# EAGLE design MCAT-CANYVAL-BPR-5X (EAGLE 7.2.0)
DATECODE: 20150302102847; REV: 5X
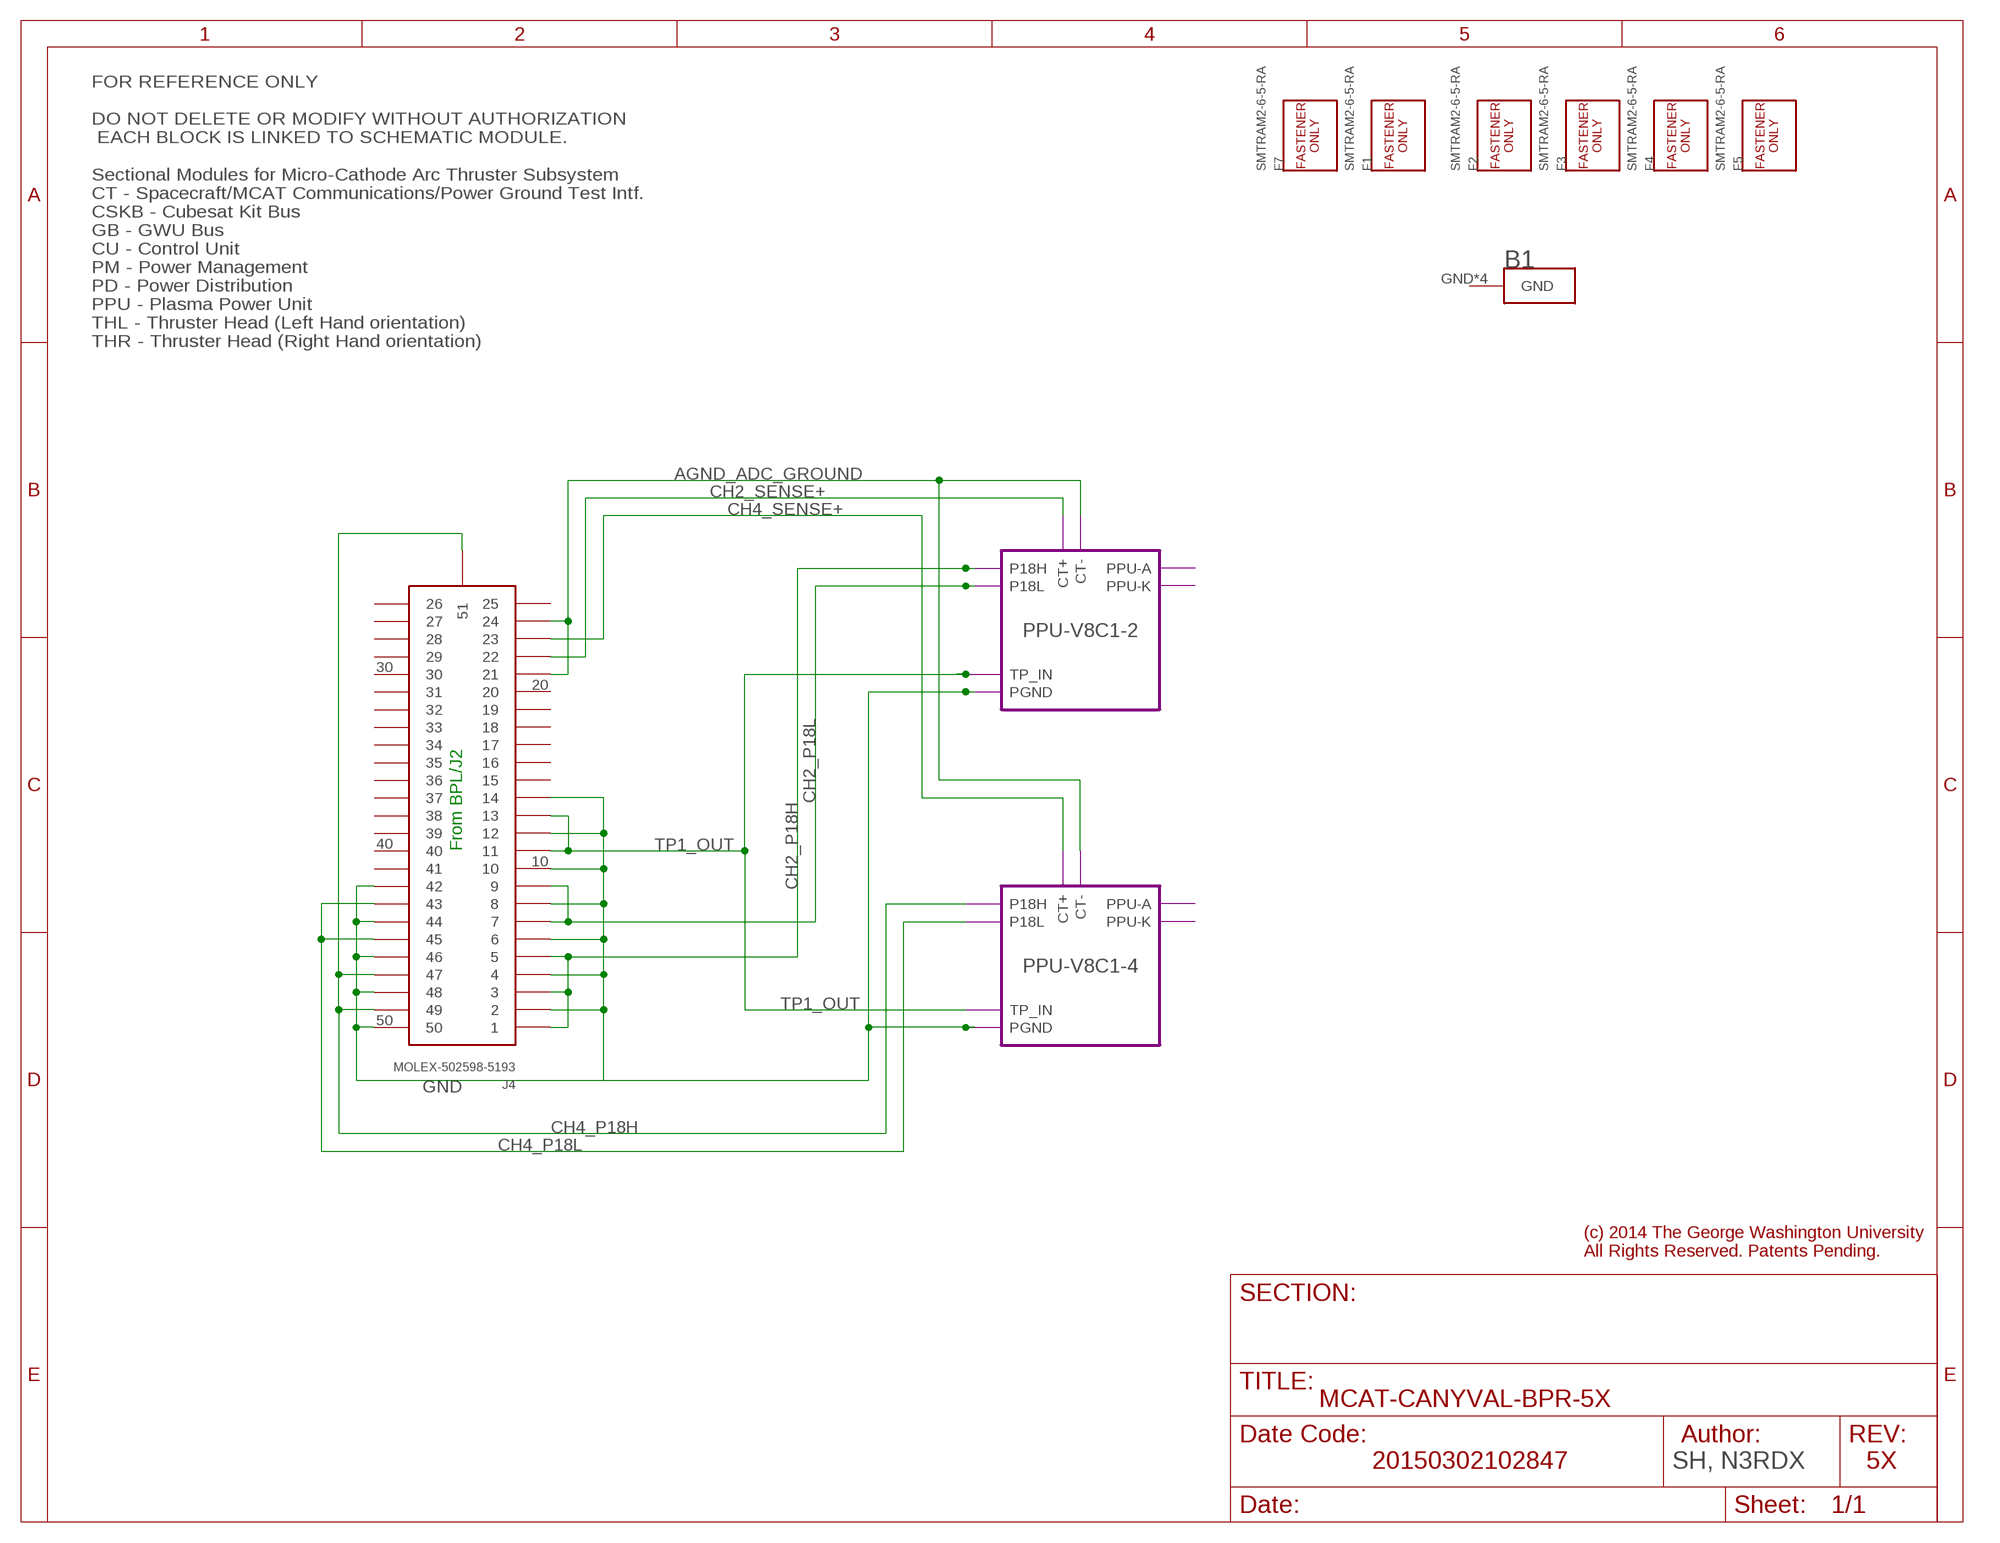
[diagram p0: schematic, sheet 1]

## Parts
B1  MCAT-4CU-C-PCB/BPR  [MCAT-4CU-C-BPR-V4-BLANK]
F1  SMTRAM2-6-5-RA  [SMTRA-M2-6-5-RA]
F2  SMTRAM2-6-5-RA  [SMTRA-M2-6-5-RA]
F3  SMTRAM2-6-5-RA  [SMTRA-M2-6-5-RA]
F4  SMTRAM2-6-5-RA  [SMTRA-M2-6-5-RA]
F5  SMTRAM2-6-5-RA  [SMTRA-M2-6-5-RA]
F7  SMTRAM2-6-5-RA  [SMTRA-M2-6-5-RA]
J4  MOLEX-502598-5193  [MOLEX-502598-5193]

## Module instances
PPU-V8C1-2 = PPU-V8C1
PPU-V8C1-4 = PPU-V8C1

## Nets
AGND_ADC_GROUND: J4.21 J4.24 ; port PPU-V8C1-2.CT- PPU-V8C1-4.CT-
CH2_P18H: J4.1 J4.3 J4.5 ; port PPU-V8C1-2.P18H
CH2_P18L: J4.7 J4.9 ; port PPU-V8C1-2.P18L
CH2_SENSE+: J4.22 ; port PPU-V8C1-2.CT+
CH4_P18H: J4.47 J4.49 J4.51 ; port PPU-V8C1-4.P18H
CH4_P18L: J4.43 J4.45 ; port PPU-V8C1-4.P18L
CH4_SENSE+: J4.23 ; port PPU-V8C1-4.CT+
GND: J4.2 J4.4 J4.6 J4.8 J4.10 J4.12 J4.14 J4.42 J4.44 J4.46 J4.48 J4.50 ; port PPU-V8C1-2.PGND PPU-V8C1-4.PGND
N$3: port PPU-V8C1-2.PPU-K
TP1_OUT: J4.11 J4.13 ; port PPU-V8C1-2.TP_IN PPU-V8C1-4.TP_IN
Unconnected: B1.GND B1.GND@1(GND) B1.GND@2(GND) B1.GND@3(GND) J4.15 J4.16 J4.17 J4.18 J4.19 J4.20 J4.25 J4.26 J4.27 J4.28 J4.29 J4.30 J4.31 J4.32 J4.33 J4.34 J4.35 J4.36 J4.37 J4.38 J4.39 J4.40 J4.41

## Notes on the sheet
- FOR REFERENCE ONLY
  
  DO NOT DELETE OR MODIFY WITHOUT AUTHORIZATION
   EACH BLOCK IS LINKED TO SCHEMATIC MODULE.
  
  Sectional Modules for Micro-Cathode Arc Thruster Subsystem
  CT - Spacecraft/MCAT Communications/Power Ground Test Intf.
  CSKB - Cubesat Kit Bus
  GB - GWU Bus
  CU - Control Unit
  PM - Power Management
  PD - Power Distribution
  PPU - Plasma Power Unit
  THL - Thruster Head (Left Hand orientation)
  THR - Thruster Head (Right Hand orientation)
- From BPL/J2
- SH, N3RDX

## Library data of the parts
B1 = gwu_mpnl_ucat_v10:MCAT-4CU-C-PCB; COPYRIGHT: (c) 2015. The George Washington University; PCBLABEL: BPR
F1-F5 F7 = gwu_mpnl_ucat_v10:SMTRA: Type SMTRA - ReelFast Surface Mount Right Angle (R'ANGLE) Fastener (Metric); MF: PENNEngineering; MPN: SMTRAM2-6-5ET
J4 = gwu_mpnl_ucat_v10:MOLEX-502598-5193: MOLEX 0.3MM PITCH FPC CONN MALE 51 CKTS MOLEX 502598-5193 based upon SD-502598-003 (2012/08/01); MF: MOLEX; MPN: 502598-5193

## Module PPU-V8C1
Ports: PGND(pwr) P18L(in) P18H(in) TP_IN(in) CT+(io) CT-(io) PPU-A(io) PPU-K(io)
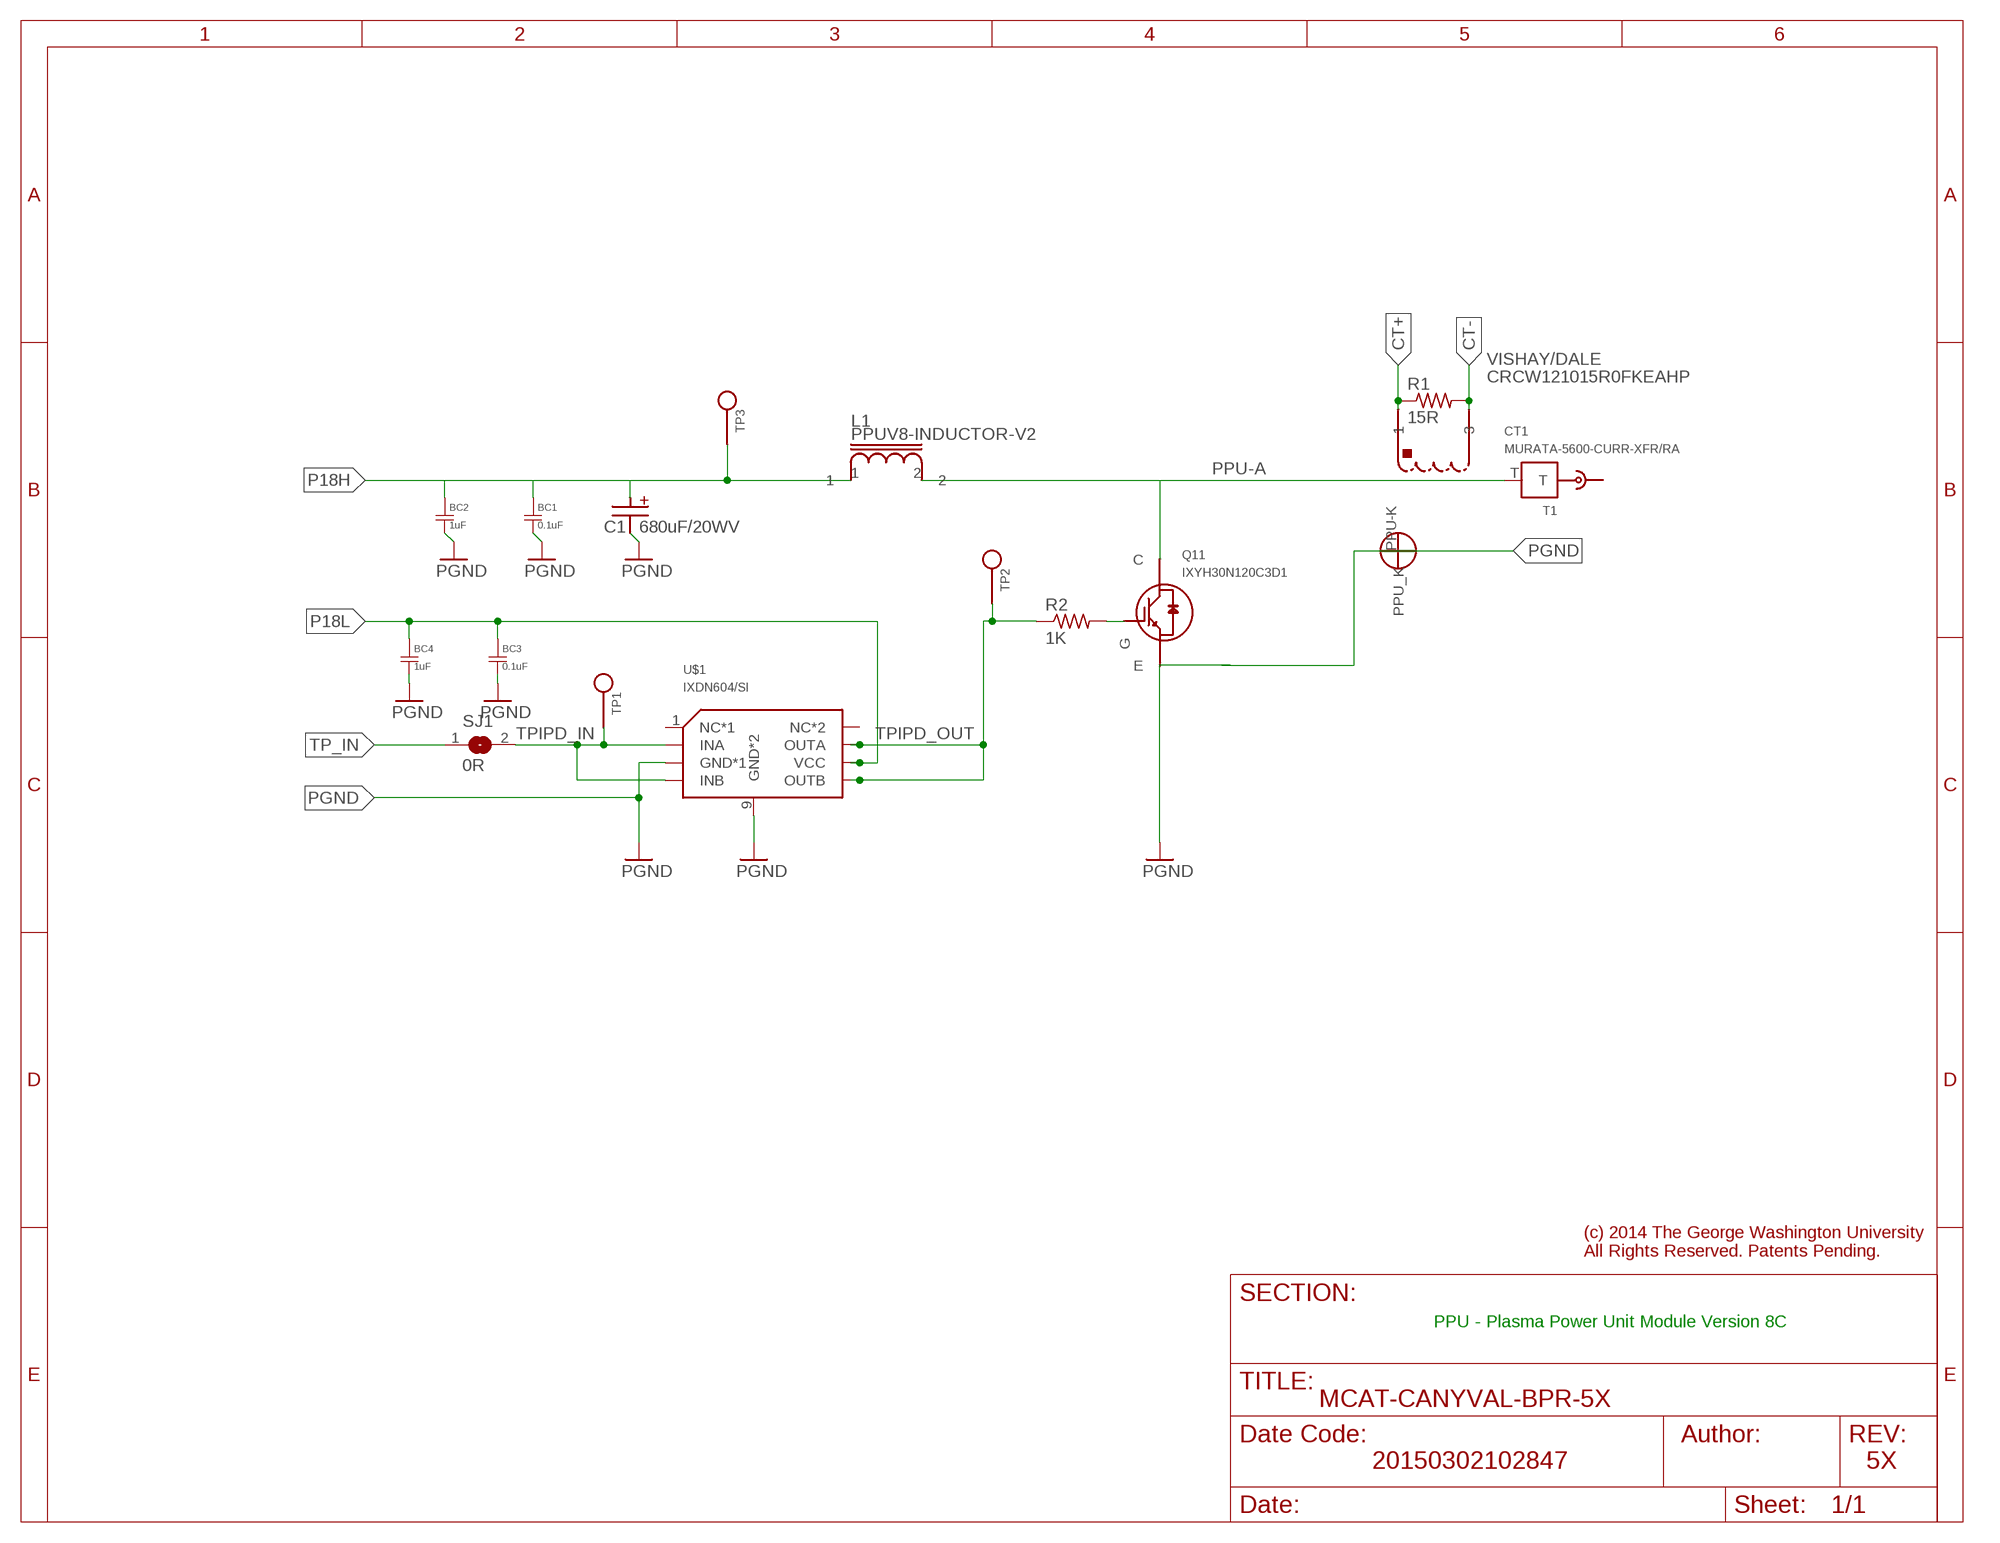
[diagram p1: schematic, module PPU-V8C1, sheet 1]

### Parts
BC1  BYPASS-CAP-0.1UF  [0612-REV]
BC2  BYPASS-CAP-1UF  [0612-REV]
BC3  BYPASS-CAP-0.1UF  [0612-REV]
BC4  BYPASS-CAP-1UF  [0612-REV]
C1  680uF/20WV  APSG200ELL681MJB5S  [CHEMI-CON-PSG-JB5]
CT1  MURATA-5600-CURR-XFR/RA  [MURATA-5600-SERIES-CURR-XFR-RA]
L1  PPUV8-INDUCTOR-V2  [PPUV8-INDUCTOR-V2]
Q11  IXYH30N120C3D1  IXYH30N120C3D1/V  [IXYS-TO-247-AD-VERT]
R1  15R  R-US_R1210  [R1210]
R2  1K  R-US_R0805  [R0805]
SJ1  0R  SJ  [SJ]
T1  MCAT-SPADE-TERMINAL  [SPADE-TERMINAL-FLANGED-NYLON-INSULATED]
TP1  PCB-MINI-SMD-TESTPOINT/SQ  [PCB-MINI-SMD-TESTPOINT]
TP2  PCB-MINI-SMD-TESTPOINT/SQ  [PCB-MINI-SMD-TESTPOINT]
TP3  PCB-MINI-SMD-TESTPOINT/SQ  [PCB-MINI-SMD-TESTPOINT]
U$1  IXDN604/SI  [IXYS-SI-8PIN-POWER-SOIC]

### Nets
CT+: CT1.1 R1.1
CT-: CT1.3 R1.2
N$2: Q11.G R2.2
P18H [P18H-0.6A-CKT]: BC1.1 BC2.1 C1.POS(CAP_POS) L1.1 TP3.1(TP)
P18L: BC3.1 BC4.1 U$1.6(VCC)
PGND: BC1.2 BC2.2 BC3.2 BC4.2 C1.NEG(CAP_NEG) CT1.PPU-K(PPU_K) Q11.E U$1.3(GND*1) U$1.9(GND*2)
PPU-A: L1.2 Q11.C T1.T
TP_IN: SJ1.1
TPIPD_IN: SJ1.2 TP1.1(TP) U$1.2(INA) U$1.4(INB)
TPIPD_OUT: R2.1 TP2.1(TP) U$1.5(OUTB) U$1.7(OUTA)
Unconnected: U$1.1(NC*1) U$1.8(NC*2)

### Notes on the sheet
- PPU - Plasma Power Unit Module Version 8C

### Library data of the parts
BC1 BC3 = gwu_mpnl_ucat_v10:BYPASS-CAP-0.1UF; MF: AVX; MPN: 06123C104KAT2A
BC2 BC4 = gwu_mpnl_ucat_v10:BYPASS-CAP-1UF; MF: AVX; MPN: 0612YC105KAT2A
C1 = samudra_ucat_v9:APSG200ELL681MJB5S; MF: United Chemi-Con; MPN: APSG200ELL681MJB5S
CT1 = gwu_mpnl_ucat_v10:MURATA-5600-CURR-XFR; MF: MURATA; MPN: 56050C
L1 = gwu_mpnl_ucat_v10:PPUV8-INDUCTOR-V2: GWU MpNL Custom Wound Inductor for PPUV8 1 x 1 Magnetics High Flux 58312A2 Core Winding: 18AWG Magnet Wire. Turns: See analysis report by HAQUE March 2015; MF: Magnetics; MPN: 58312-A2
Q11 = gwu_mpnl_ucat_v10:IXYH30N120C3D1; MF: IXYS; MPN: IXYH30N120C3D1
R1 = rcl:R-US_: RESISTOR, American symbol; MF: VISHAY/DALE; MPN: CRCW121015R0FKEAHP
R2 = rcl:R-US_: RESISTOR, American symbol; MF: VISHAY; MPN: PAT0805E1001BST1
SJ1 = jumper:SJ: SMD solder JUMPER; MF: VISHAY/DALE; MPN: CRCW08050000Z0EA
T1 = gwu_mpnl_ucat_v10:MCAT-SPADE-TERMINAL; MF: HARWIN; MPN: S4011-46
TP1-TP3 = gwu_mpnl_ucat_v10:PCB-MINI-SMD-TESTPOINT; MF: Keystone Electronics; MPN: 5015
U$1 = gwu_mpnl_ucat_v10:IXDN604; MF: IXYS; MPN: IXDN604SI

## Net classes
1 P18H-0.6A-CKT: width 0.203 mm
2 VOUTA-2A-CKT: width 1.016 mm

## Board
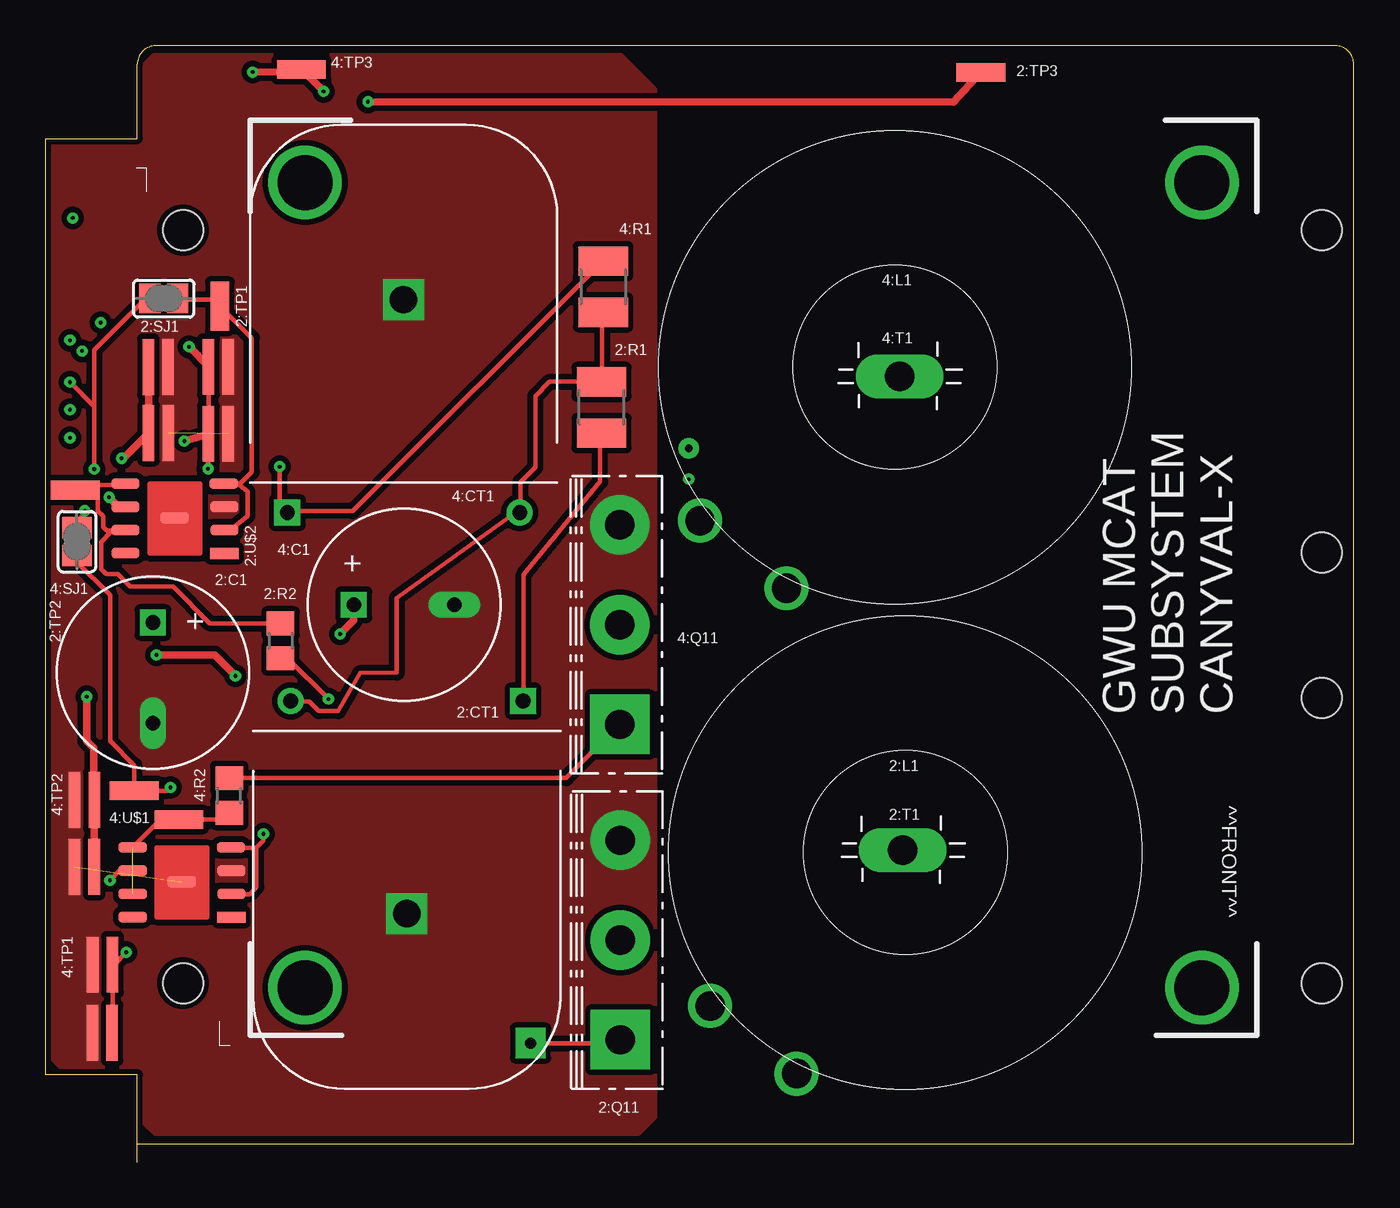
[diagram p2: board, top side]
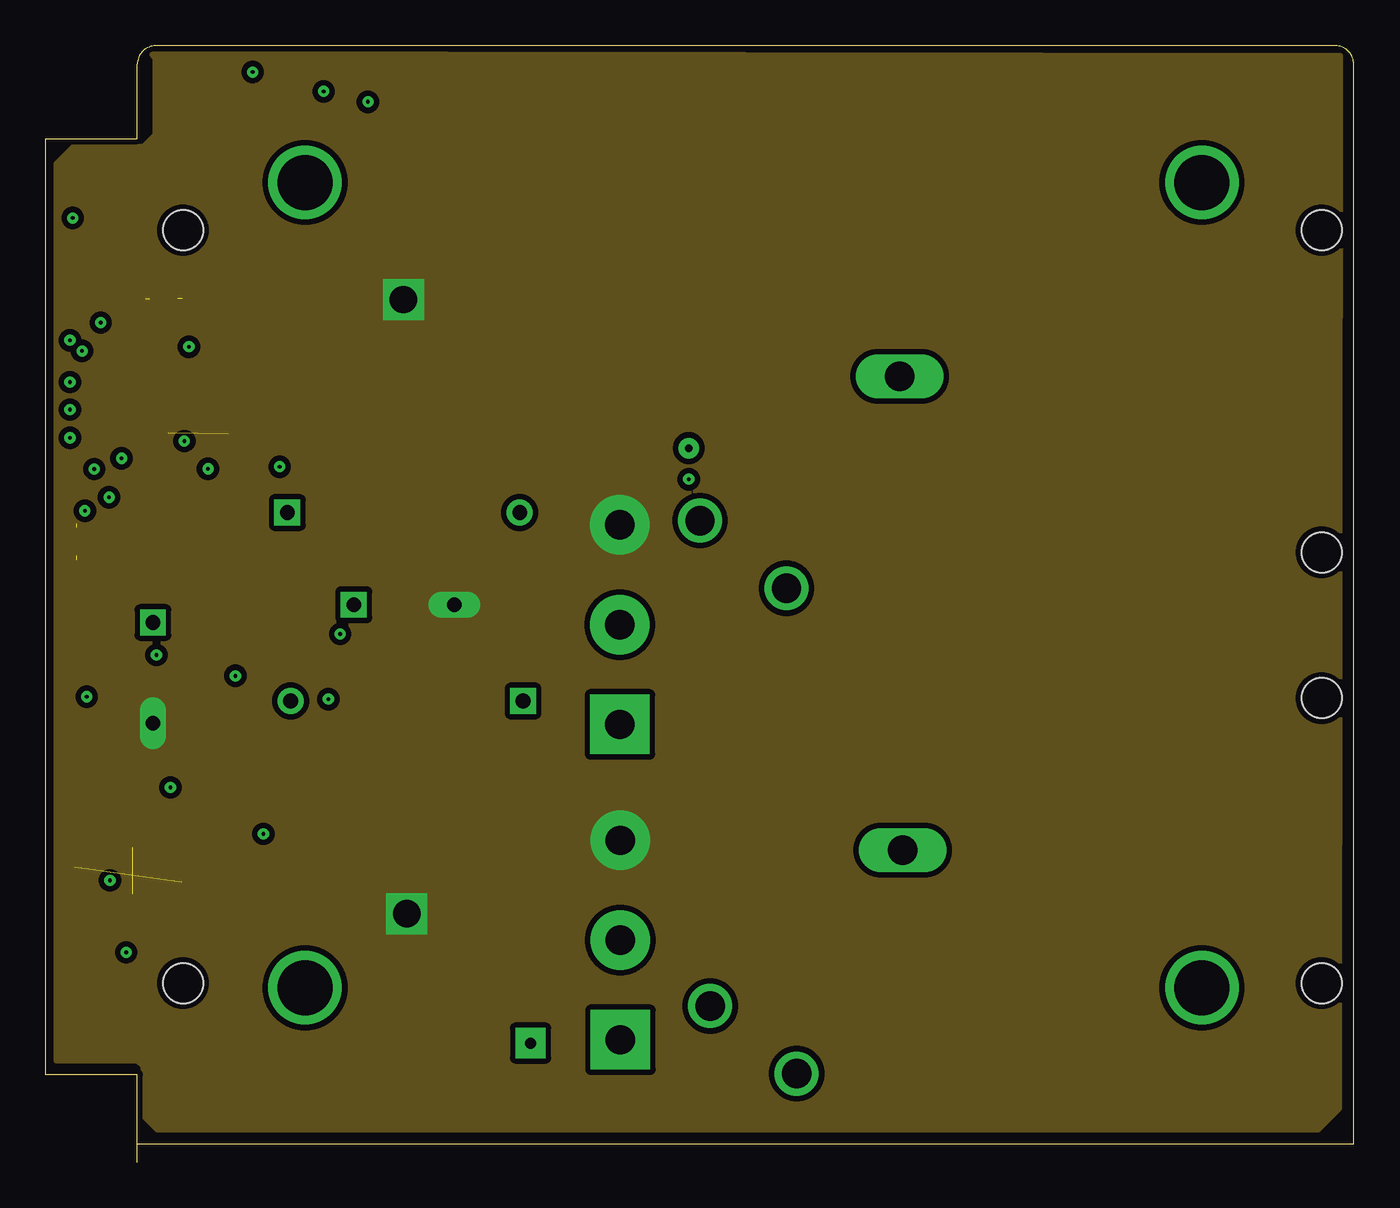
[diagram p3: board, inner layer L2/TopGround]
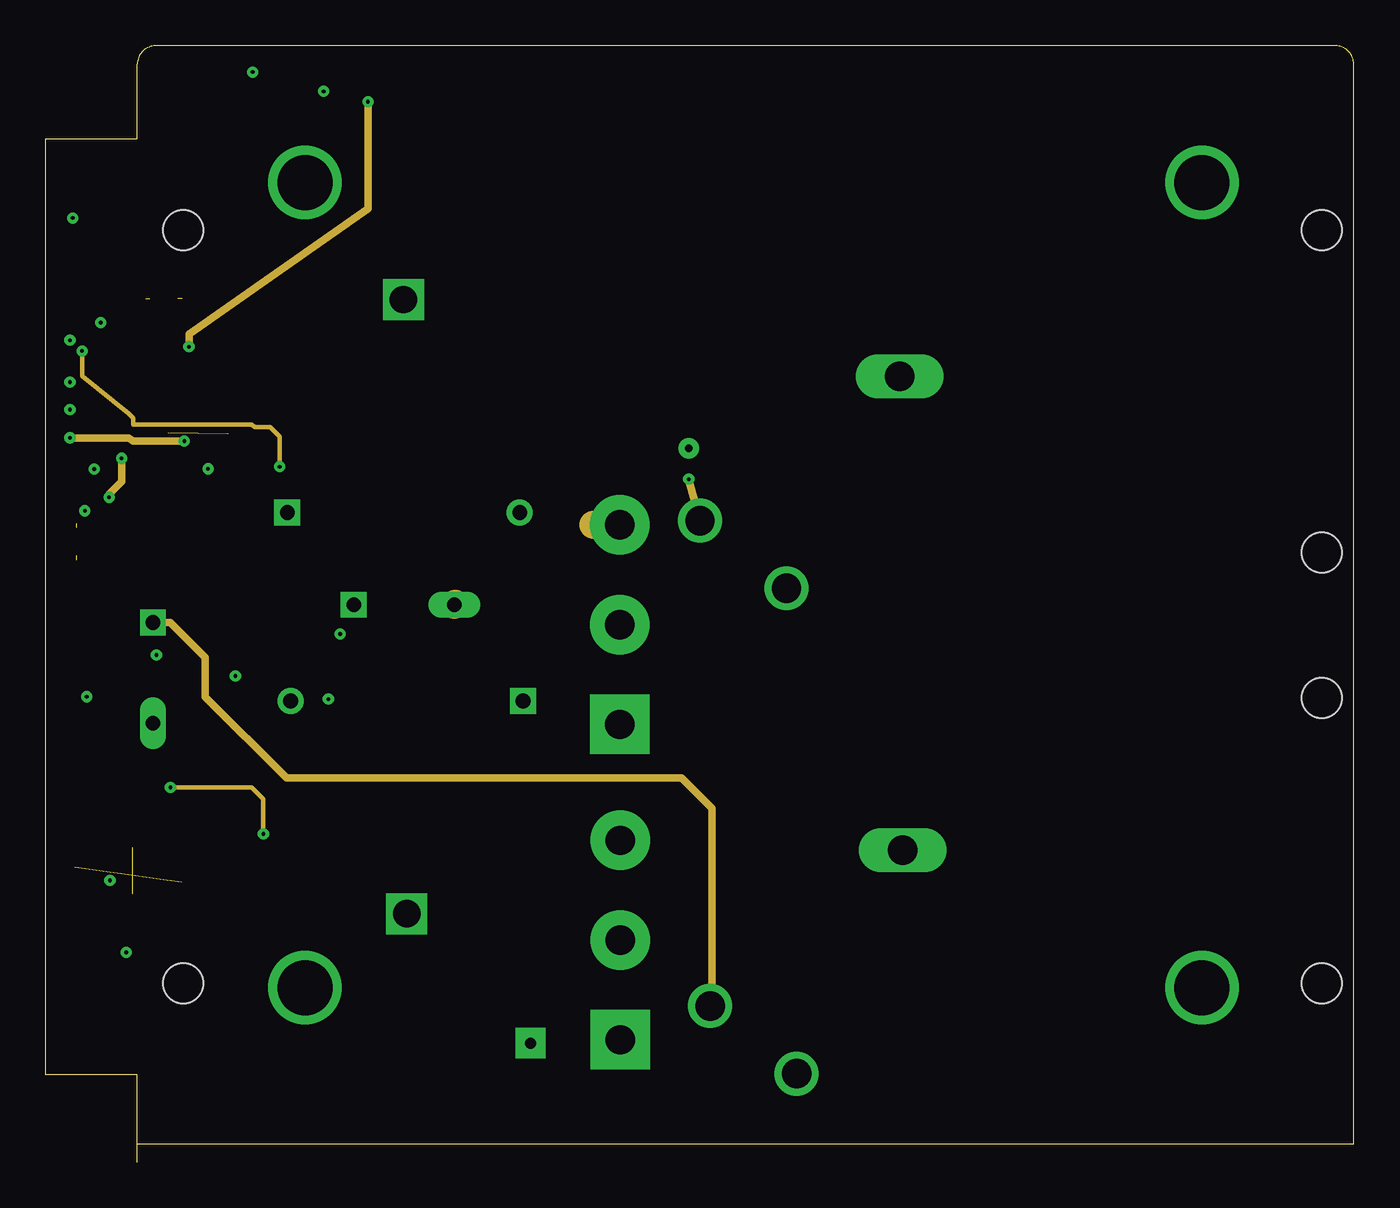
[diagram p4: board, inner layer L3/Power1]
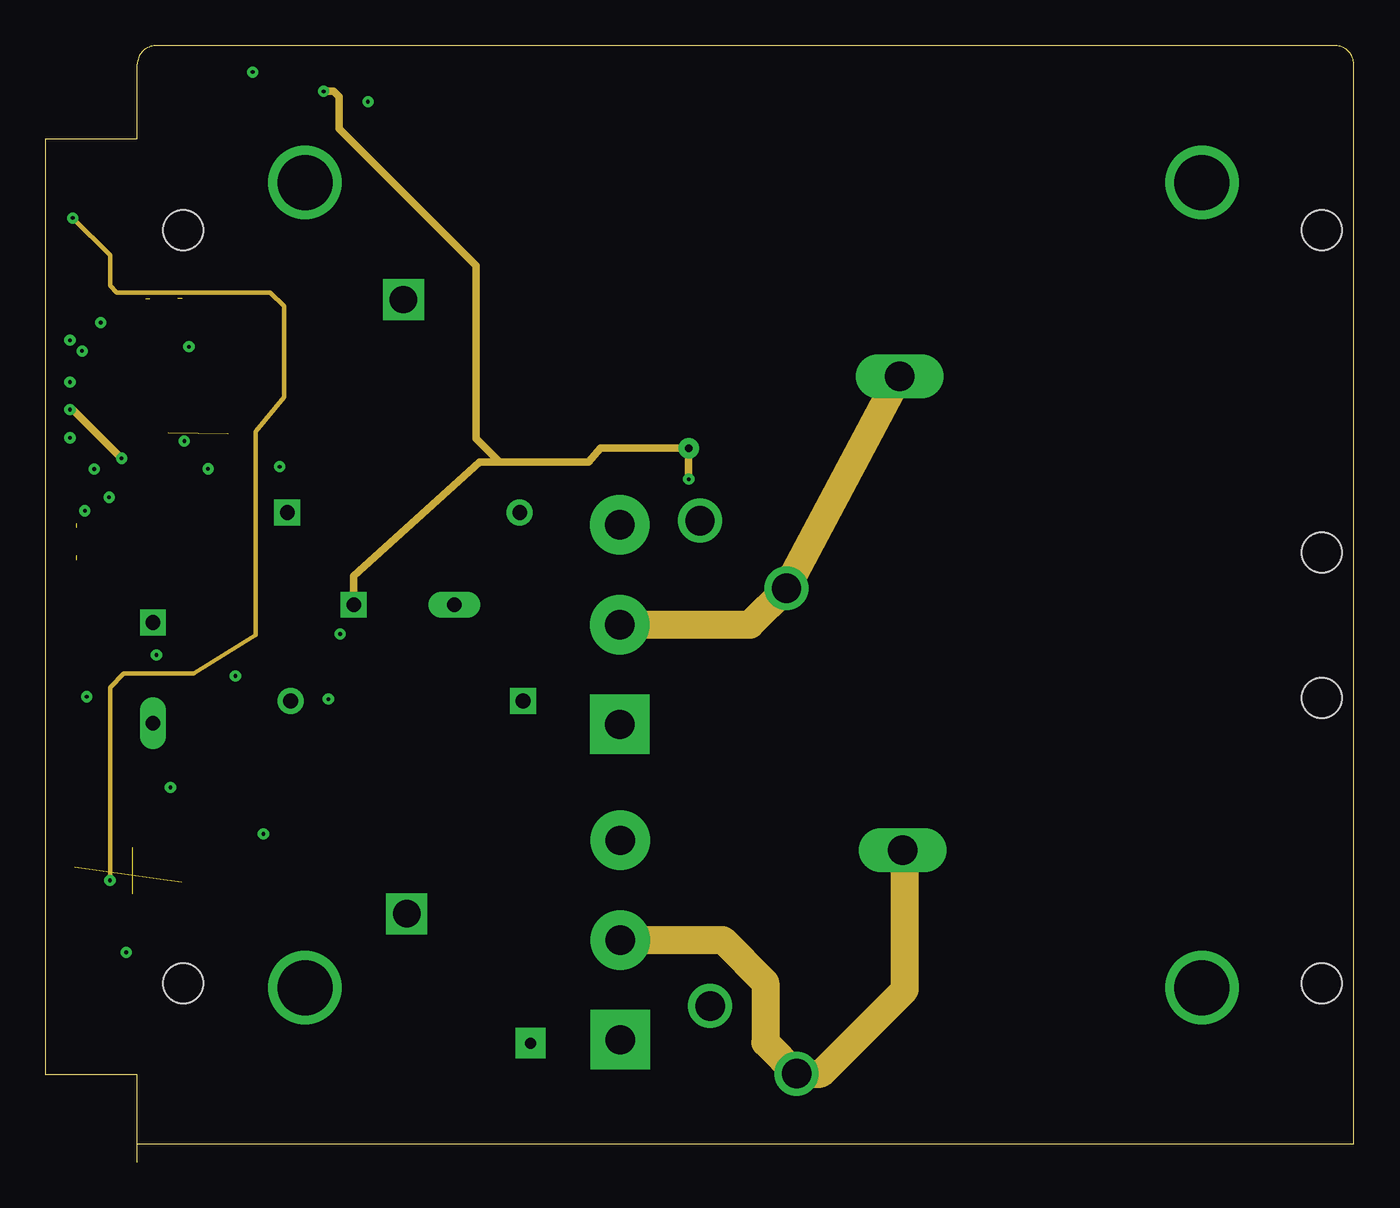
[diagram p5: board, inner layer L14/Power2]
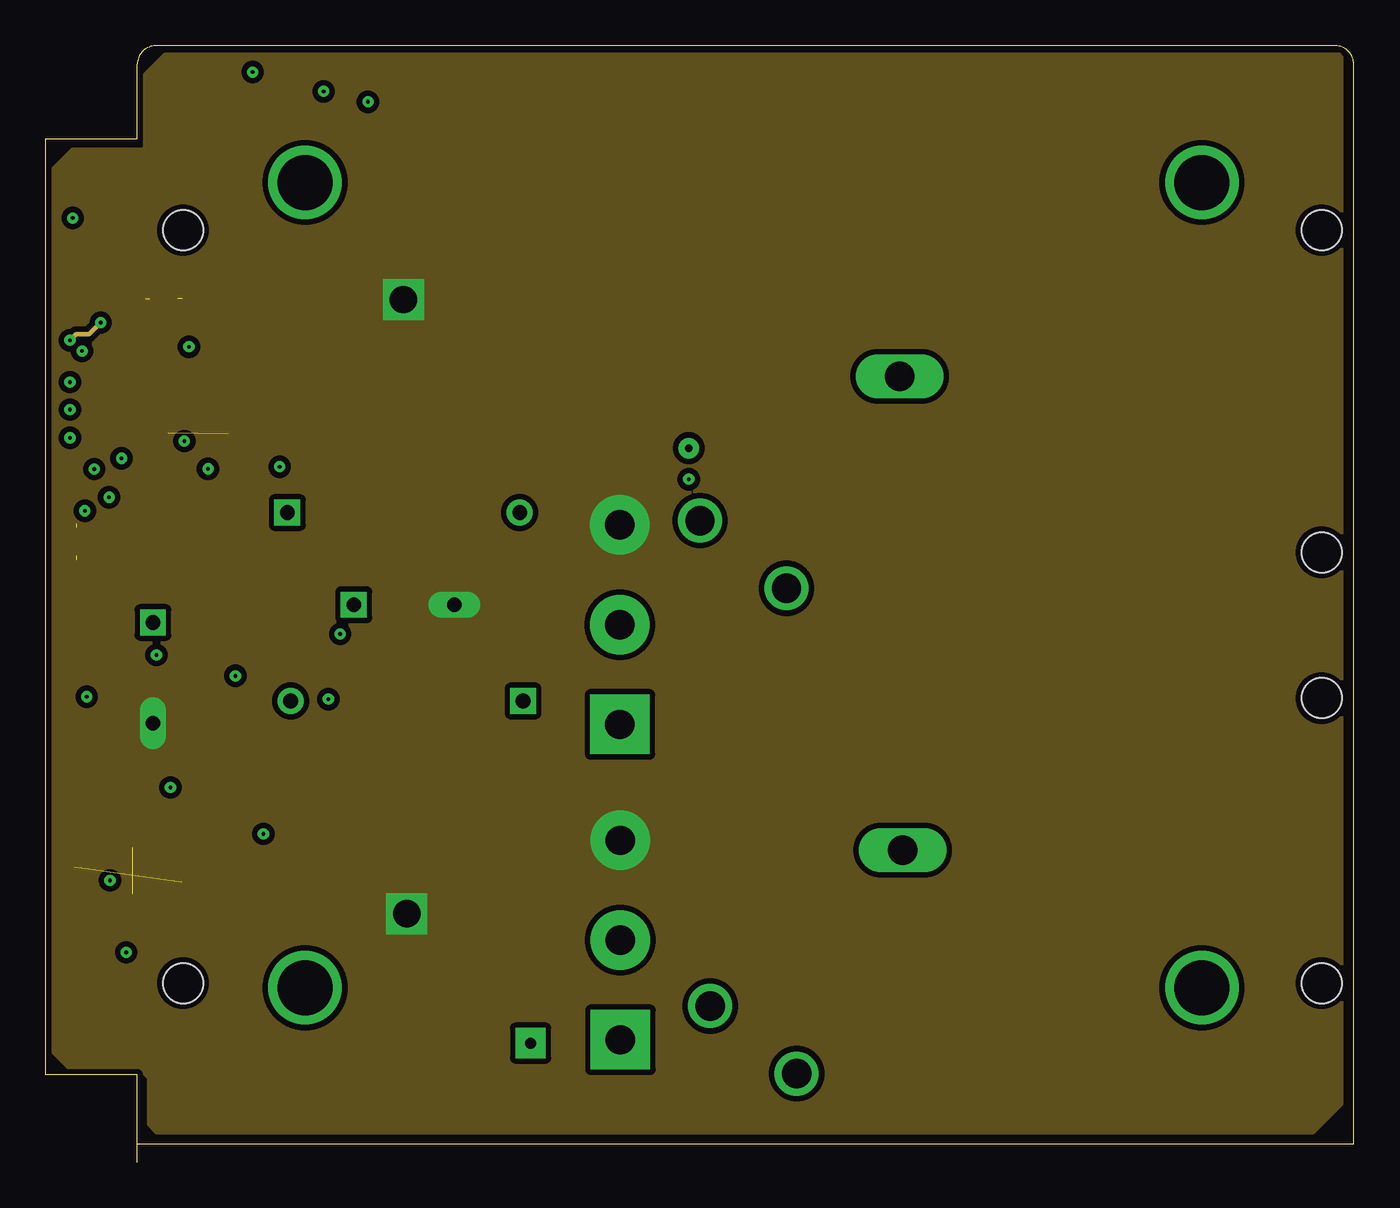
[diagram p6: board, inner layer L15/BottomGround]
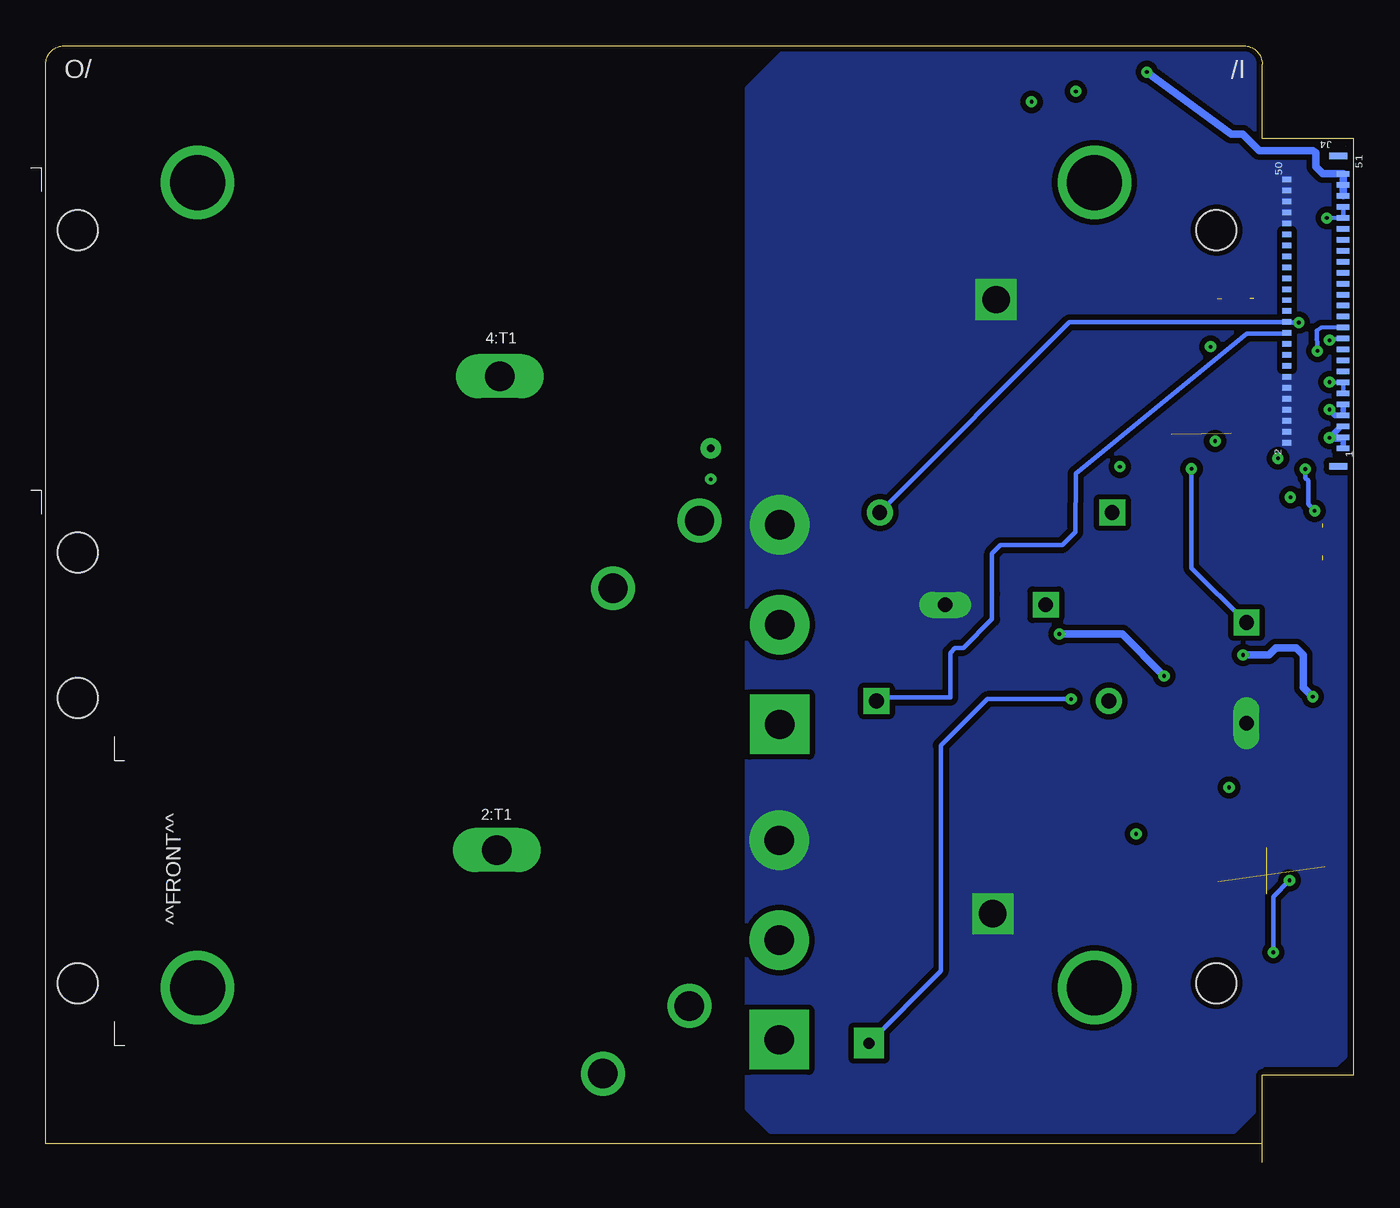
[diagram p7: board, bottom side, seen from below]

Size 71.47 x 61 mm. Coordinates in mm from the lower left corner, seen from the top.
Copper layers (1+2*3+14*15+16): L1/TopSignal 0.035559375mm / dielectric 3.5mil / L2/TopGround 0.01778125mm / dielectric 47mil / L3/Power1 0.0356mm / dielectric 12mil / L14/Power2 0.0356mm / dielectric 0.1499mm / L15/BottomGround 0.01778125mm / dielectric 3.5mil / L16/BottomSignal 0.035559375mm
Design rules "mcat-4cu-c-X3": minimum track width 6mil, minimum drill 8mil, track to track 10mil, track to pad 6mil, pad to pad 6mil, via to via 6mil, smd to smd 1mil, copper to edge 10mil, drill to drill 5mil, minimum pad ring 12mil, minimum via ring 8mil, stop-mask expansion 0mil, vias tented up to drill 8mil, thermal gap 10mil

### Footprints (pad centres in the part's own frame; a part is rotated, then mirrored left to right if it is on the bottom)
MCAT-4CU-C-BPR-V4-BLANK = drill 3: GND 9.17,9.025; GND@1 9.17,53.025; GND@2 58.17,53.025; GND@3 58.17,9.025
SMTRA-M2-6-5-RA = hole 2.2: 0,0
MOLEX-502598-5193 = smd 0.3 x 0.67: 1 -7.5,0.135; 3 -6.9,0.135; 5 -6.3,0.135; 7 -5.7,0.135; 9 -5.1,0.135; 11 -4.5,0.135; 13 -3.9,0.135; 15 -3.3,0.135; 17 -2.7,0.135; 19 -2.1,0.135; 21 -1.5,0.135; 23 -0.9,0.135; 25 -0.3,0.135; 27 0.3,0.135; 29 0.9,0.135; 31 1.5,0.135; 33 2.1,0.135; 35 2.7,0.135; 37 3.3,0.135; 39 3.9,0.135; 41 4.5,0.135; 43 5.1,0.135; 45 5.7,0.135; 47 6.3,0.135; 49 6.9,0.135; 51 7.5,0.135 | smd 0.3 x 0.5: 2 -7.2,3.2; 4 -6.6,3.2; 6 -6,3.2; 8 -5.4,3.2; 10 -4.8,3.2; 12 -4.2,3.2; 14 -3.6,3.2; 16 -3,3.2; 18 -2.4,3.2; 20 -1.8,3.2; 22 -1.2,3.2; 24 -0.6,3.2; 26 0,3.2; 28 0.6,3.2; 30 1.2,3.2; 32 1.8,3.2; 34 2.4,3.2; 36 3,3.2; 38 3.6,3.2; 40 4.2,3.2; 42 4.8,3.2; 44 5.4,3.2; 46 6,3.2; 48 6.6,3.2; 50 7.2,3.2 | smd 0.35 x 1: 99 -8.475,0.4; 100 8.475,0.4
0612-REV = smd 3.05 x 0.635: 1 0,0; 2 0,1.077
CHEMI-CON-PSG-JB5 = drill 0.8 long: NEG -2.75,0 | drill 0.8 square: POS 2.75,0
MURATA-5600-SERIES-CURR-XFR-RA = drill 0.8 square: 1 2.04,-1.63 | drill 0.8: 3 14.74,-1.63 | drill 1.5 square: PPU-K 8.395,10
PPUV8-INDUCTOR-V2 = drill 1.6: 1 8.385,-10.656; 2 12.076,-5.932
IXYS-TO-247-AD-VERT = drill 1.6 pad 3.25: C 5.45,0; E 10.9,0 | drill 1.6 pad 3.25 square: G 0,0
R1210 = smd 1.6 x 2.7: 1 -1.4,0; 2 1.4,0
R0805 = smd 1.3 x 1.5: 1 -0.95,0; 2 0.95,0
SJ = smd 1.168 x 1.6: 1 -0.762,0; 2 0.762,0
SPADE-TERMINAL-FLANGED-NYLON-INSULATED = drill 1.6 long: T 0,0
PCB-MINI-SMD-TESTPOINT = smd 2.667 x 1.016: 1 0,0
IXYS-SI-8PIN-POWER-SOIC = smd 0.6 x 1.55: 1 0,0; 2 1.27,0; 3 2.54,0; 4 3.81,0.03; 5 3.81,5.4; 6 2.54,5.4; 7 1.27,5.4; 8 0.01,5.4; 9 1.94,2.72

### Placement (x,y rotation side)
B1  5,0.5 0 top
F1  7.5,50.92 180 top
F2  69.72,33.31 180 bottom
F3  69.72,50.92 180 bottom
F4  69.72,25.35 0 bottom
F5  69.72,9.77 0 bottom
F7  7.5,9.77 0 top
J4  0.45,46.5 90 bottom
PPU-V8C1-2:BC1  BYPASS-CAP-0.1UF  [0612-REV]  8.89,43.46 270 top
PPU-V8C1-2:BC2  BYPASS-CAP-1UF  [0612-REV]  8.89,39.79 270 top
PPU-V8C1-2:BC3  BYPASS-CAP-0.1UF  [0612-REV]  5.62,39.83 270 top
PPU-V8C1-2:BC4  BYPASS-CAP-1UF  [0612-REV]  5.6,43.45 270 top
PPU-V8C1-2:C1  680uF/20WV  [CHEMI-CON-PSG-JB5]  5.86,26.74 90 top
PPU-V8C1-2:CT1  MURATA-5600-CURR-XFR/RA  [MURATA-5600-SERIES-CURR-XFR-RA]  28.12,23.57 180 top
PPU-V8C1-2:L1  PPUV8-INDUCTOR-V2  [PPUV8-INDUCTOR-V2]  46.96,16.91 270 top
PPU-V8C1-2:Q11  IXYH30N120C3D1  [IXYS-TO-247-AD-VERT]  31.4,6.68 90 top
PPU-V8C1-2:R1  15R  [R1210]  30.37,41.24 90 top
PPU-V8C1-2:R2  1K  [R0805]  12.83,28.48 270 top
PPU-V8C1-2:SJ1  0R  [SJ]  6.45,47.19 0 top
PPU-V8C1-2:T1  MCAT-SPADE-TERMINAL  [SPADE-TERMINAL-FLANGED-NYLON-INSULATED]  46.83,17.05 0 top
PPU-V8C1-2:TP1  PCB-MINI-SMD-TESTPOINT/SQ  [PCB-MINI-SMD-TESTPOINT]  9.52,46.77 270 top
PPU-V8C1-2:TP2  PCB-MINI-SMD-TESTPOINT/SQ  [PCB-MINI-SMD-TESTPOINT]  1.61,36.72 180 top
PPU-V8C1-2:TP3  PCB-MINI-SMD-TESTPOINT/SQ  [PCB-MINI-SMD-TESTPOINT]  51.11,59.54 180 top
PPU-V8C1-2:U$1  IXDN604/SI  [IXYS-SI-8PIN-POWER-SOIC]  9.76,33.27 90 top
PPU-V8C1-4:BC1  BYPASS-CAP-0.1UF  [0612-REV]  2.65,16.13 90 top
PPU-V8C1-4:BC2  BYPASS-CAP-1UF  [0612-REV]  2.65,19.78 90 top
PPU-V8C1-4:BC3  BYPASS-CAP-0.1UF  [0612-REV]  3.62,7.07 90 top
PPU-V8C1-4:BC4  BYPASS-CAP-1UF  [0612-REV]  3.65,10.79 90 top
PPU-V8C1-4:C1  680uF/20WV  [CHEMI-CON-PSG-JB5]  19.58,30.45 180 top
PPU-V8C1-4:CT1  MURATA-5600-CURR-XFR/RA  [MURATA-5600-SERIES-CURR-XFR-RA]  11.16,37.13 0 top
PPU-V8C1-4:L1  PPUV8-INDUCTOR-V2  [PPUV8-INDUCTOR-V2]  46.41,43.43 270 top
PPU-V8C1-4:Q11  IXYH30N120C3D1  [IXYS-TO-247-AD-VERT]  31.37,23.92 90 top
PPU-V8C1-4:R1  15R  [R1210]  30.45,47.83 270 top
PPU-V8C1-4:R2  1K  [R0805]  10.03,20.03 90 top
PPU-V8C1-4:SJ1  0R  [SJ]  1.7,33.91 270 top
PPU-V8C1-4:T1  MCAT-SPADE-TERMINAL  [SPADE-TERMINAL-FLANGED-NYLON-INSULATED]  46.65,42.94 0 top
PPU-V8C1-4:TP1  PCB-MINI-SMD-TESTPOINT/SQ  [PCB-MINI-SMD-TESTPOINT]  4.83,20.29 180 top
PPU-V8C1-4:TP2  PCB-MINI-SMD-TESTPOINT/SQ  [PCB-MINI-SMD-TESTPOINT]  7.28,18.72 0 top
PPU-V8C1-4:TP3  PCB-MINI-SMD-TESTPOINT/SQ  [PCB-MINI-SMD-TESTPOINT]  13.97,59.7 180 top
PPU-V8C1-4:U$1  IXDN604/SI  [IXYS-SI-8PIN-POWER-SOIC]  10.15,13.38 90 top

### Tracks (layer width: path | path; a pad name or v marks a point on that pad's centre or on a via)
AGND_ADC_GROUND  (via drill 0.2 pad 0.56)
  L1/TopSignal 0.254: PPU-V8C1-4:R1.2 30.38,46.42 30.38,42.68 PPU-V8C1-2:R1.2 27.54,42.65 26.75,41.86 26.75,37.97 25.94,37.16 25.94,35.57 PPU-V8C1-4:CT1.3 25.85,35.48 25.67,35.48 19.18,30.82 19.18,29.67 19.18,26.75 17.17,26.72 15.98,24.64 14.91,24.64 14.38,25.17 13.4,25.17 PPU-V8C1-2:CT1.3
  L15/BottomGround 0.254: v1.33,44.91 1.66,45.24 2.37,45.24 v3,45.87
  L16/BottomSignal 0.254: PPU-V8C1-4:CT1.3 25.85,35.57 15.54,45.88 3.71,45.88 J4.24 3.62,45.87 v3,45.87 | J4.21 0.86,45 v1.33,44.91
CH2_P18H  (via drill 0.2)
  L1/TopSignal 0.254: v8.87,37.88 8.87,39.75 PPU-V8C1-2:BC2.1 PPU-V8C1-2:BC1.1
  L1/TopSignal 0.406: v7.57,39.4 PPU-V8C1-2:BC2.1 | PPU-V8C1-2:BC1.1 v7.83,44.55 | PPU-V8C1-2:TP3.1 49.61,57.91 v17.61,57.94
  L3/Power1 0.406: PPU-V8C1-2:C1.POS 6.81,29.49 8.72,27.58 8.72,25.42 13.16,20.98 34.75,20.98 36.4,19.33 36.4,8.62 | v1.33,39.57 4.53,39.57 4.78,39.4 v7.57,39.4 | v7.83,44.55 7.83,45.24 17.61,52.09 v17.61,57.94
  L3/Power1 1.524: 36.4,8.62 PPU-V8C1-2:L1.1
  L16/BottomSignal 0.254: v8.87,37.88 8.87,32.46 5.94,29.53 PPU-V8C1-2:C1.POS
  L16/BottomSignal 0.305: 0.61,39.57 J4.3 J4.1 | J4.5 0.7,40.2 v1.33,39.57
  L16/BottomSignal 0.406: v1.33,39.57 0.61,39.57
CH2_P18L  (via drill 0.2)
  L1/TopSignal 0.406: v4.14,38.45 4.24,38.45 PPU-V8C1-2:BC3.1 5.62,43.43 PPU-V8C1-2:BC4.1 | PPU-V8C1-2:U$1.6 3.97,35.81 v3.46,36.32
  L3/Power1 0.406: v4.14,38.45 4.14,37.19 3.46,36.5 v3.46,36.32
  L14/Power2 0.406: v1.33,41.12 1.48,41.12 v4.14,38.45
  L16/BottomSignal 0.305: J4.9 J4.7 1,40.8 v1.33,41.12
CH2_SENSE+
  L1/TopSignal 0.254: PPU-V8C1-2:R1.1 30.29,39.75 30.29,37.17 26.11,32.1 26.11,25.26 PPU-V8C1-2:CT1.1
  L16/BottomSignal 0.254: J4.22 3.71,45.26 5.85,45.26 15.19,37.62 15.22,34.42 15.93,33.7 19.31,33.7 19.77,33.25 19.77,31.06 19.77,29.67 21.34,28.09 21.78,28.09 22.05,27.82 22.05,25.39 25.34,25.39 26.03,25.26 PPU-V8C1-2:CT1.1
CH4_P18H  (via drill 0.2, 0.41 pad 0.76)
  L1/TopSignal 0.254: 14.02,59.66 PPU-V8C1-4:TP3.1 13.86,59.59 | 16.78,30.42 PPU-V8C1-4:C1.POS | 2.62,19.82 PPU-V8C1-4:BC2.1
  L1/TopSignal 0.406: v15.18,58.51 14.02,59.66 | v11.31,59.56 13.86,59.59 | 2.62,19.82 2.62,22.63 2.24,23.01 v2.24,25.42 | v6.05,27.71 9.22,27.71 v10.37,26.57 | PPU-V8C1-4:BC2.1 PPU-V8C1-4:BC1.1 | v16.08,28.85 16.83,29.6 PPU-V8C1-4:C1.POS
  L3/Power1 0.406: v35.13,37.31 PPU-V8C1-4:L1.1
  L14/Power2 0.406: PPU-V8C1-4:C1.POS 16.83,32.02 23.7,38.25 24.79,38.25 | 24.79,38.25 29.67,38.25 30.31,39.01 30.81,39.01 v35.13,39.01 v35.13,37.31 | v15.18,58.51 15.62,58.51 15.74,58.51 16.03,58.22 16.03,56.46 23.52,48.97 23.52,39.52 24.79,38.25
  L16/BottomSignal 0.406: v11.31,59.56 6.68,56.16 6.05,56.16 5.16,55.27 2.24,55.27 2.09,55.14 2.06,55.12 2.06,54.38 1.68,54 0.97,54 J4.51 J4.49 J4.47 | v2.24,25.42 2.75,25.93 2.75,27.71 3.13,28.09 4.27,28.09 4.65,27.71 v6.05,27.71 | v10.37,26.57 12.65,28.85 v16.08,28.85
CH4_P18L  (via drill 0.2, 0.2 pad 0.56)
  L1/TopSignal 0.254: PPU-V8C1-4:BC3.1 3.65,7.07 PPU-V8C1-4:BC4.1 3.73,10.79 v4.4,11.45 | v3.51,15.39 4.02,15.9 4.72,15.9 PPU-V8C1-4:U$1.6
  L14/Power2 0.254: v1.48,51.59 3.51,49.55 3.51,47.9 3.89,47.52 12.27,47.52 13.03,46.76 13.03,41.81 11.46,39.93 11.46,36.8 11.46,28.8 8.08,26.7 4.27,26.7 3.51,25.93 v3.51,15.39
  L16/BottomSignal 0.254: v4.4,11.45 4.4,14.5 v3.51,15.39 | J4.45 J4.43 v1.48,51.59
CH4_SENSE+  (via drill 0.2)
  L1/TopSignal 0.254: 13.22,35.57 16.78,35.57 30.38,49.17 PPU-V8C1-4:R1.1 | 13.22,35.57 PPU-V8C1-4:CT1.1 | 13.22,35.57 12.78,35.57 v12.78,38
  L3/Power1 0.254: v12.78,38 12.78,39.65 12.27,40.16 11.41,40.16 11.26,40.31 4.78,40.31 4.78,40.66 4.53,40.89 1.99,42.95 v1.99,44.32
  L16/BottomSignal 0.254: v1.99,44.32 2.01,45.44 1.78,45.59 0.6,45.62 J4.23
GND  (2 unrouted)
  L1/TopSignal 0.254: PPU-V8C1-4:BC3.2 2.57,7.07
  L3/Power1 1.524: PPU-V8C1-4:C1.NEG 22.38,30.51 | 29.92,34.82 PPU-V8C1-4:Q11.E
  pour L1/TopSignal (isolate 0.305, no thermals): 0.36,55.65 5.21,55.65 5.39,55.83 5.39,59.97 5.9,60.48 31.42,60.48 33.28,58.62 33.28,2.44 32.39,1.55 5.97,1.55 5.36,2.16 5.36,4.95 5.13,5.18 0.82,5.18 0.41,5.59 0.41,55.57
  pour L16/BottomSignal (isolate 0.305, no thermals): 5.11,55.63 5.39,55.91 5.39,60.27 5.69,60.58 31.25,60.58 33.15,58.67 33.15,2.92 31.88,1.65 6.56,1.65 5.46,2.74 5.46,4.9 5.39,4.98 5.26,4.98 4.93,5.31 0.94,5.31 0.46,5.79 0.46,55.47 0.51,55.52
  pour L15/BottomGround (isolate 0.305, no thermals): 70.46,60.5 6.53,60.5 5.44,59.41 5.44,55.45 5.31,55.32 1.48,55.32 0.44,54.28 0.44,5.99 1.27,5.16 5.08,5.16 5.64,4.6 5.64,2.06 6.07,1.63 69.24,1.63 70.79,3.17 70.79,60.38 70.67,60.5
  pour L2/TopGround (isolate 0.305, no thermals): 70.72,2.92 69.52,1.73 6.1,1.73 5.29,2.54 5.29,5.23 5.01,5.51 0.56,5.51 0.54,5.54 0.54,54.56 1.5,55.52 5.34,55.52 5.95,56.13 5.95,60.32 5.69,60.58 70.77,60.48
PPU-V8C1-2:N$2  (via drill 0.2 pad 0.56, 0.6)
  L1/TopSignal 0.254: PPU-V8C1-2:R2.2 13.22,27.53 v15.45,25.3 | v26.5,6.5 31.22,6.5 PPU-V8C1-2:Q11.G
  L16/BottomSignal 0.254: v15.45,25.3 20.02,25.3 22.56,22.76 22.56,10.44 v26.5,6.5
PPU-V8C1-2:PPU-A
  L14/Power2 1.524: PPU-V8C1-2:Q11.C 36.99,12.13 39.32,9.8 39.32,6.54 PPU-V8C1-2:L1.2 42.35,4.83 46.94,9.42 46.94,16.94 PPU-V8C1-2:T1.T
PPU-V8C1-2:TPIPD_IN  (1 unrouted)
  L1/TopSignal 0.254: PPU-V8C1-2:U$1.2 9.49,34.51 10.05,34.51 11.03,35.31 11.03,36.63 10.6,36.98 9.49,36.98 PPU-V8C1-2:U$1.4 | 9.4,36.99 PPU-V8C1-2:U$1.4 | 7.45,47.19 7.54,47.13 9.22,47.13 9.49,46.86 PPU-V8C1-2:TP1.1 | PPU-V8C1-2:U$1.4 9.49,37.08 10.62,37.08 11.26,37.72 11.26,45.03 PPU-V8C1-2:TP1.1 | 9.49,46.77 PPU-V8C1-2:TP1.1
PPU-V8C1-2:TPIPD_OUT
  L1/TopSignal 0.254: 2.54,36.99 1.93,36.99 1.67,36.73 PPU-V8C1-2:TP2.1 | 2.54,36.99 3.09,36.99 4.07,36.99 PPU-V8C1-2:U$1.5 | PPU-V8C1-2:R2.1 12.78,29.44 8.96,29.44 6.95,31.45 4.63,31.45 3.94,32.13 3.31,32.13 3.03,32.41 3.03,33.88 3.56,34.42 4.16,34.42 PPU-V8C1-2:U$1.7 4.07,34.51 3.32,34.51 3.13,34.7 3.13,35.31 2.85,35.59 2.85,36.69 2.54,36.99
PPU-V8C1-4:N$2
  L1/TopSignal 0.254: PPU-V8C1-4:Q11.G 28.43,20.98 PPU-V8C1-4:R2.2
PPU-V8C1-4:PPU-A
  L14/Power2 1.524: PPU-V8C1-4:Q11.C 38.48,29.37 PPU-V8C1-4:L1.2 PPU-V8C1-4:T1.T
PPU-V8C1-4:TPIPD_IN  (via drill 0.2)  (1 unrouted)
  L1/TopSignal 0.254: 1.7,32.91 1.67,32.82 3.51,30.98 3.51,23.01 4.83,21.69 PPU-V8C1-4:TP1.1 6.63,20.29 v6.81,20.47 | v11.89,17.93 11.89,17.55 11.51,17.17 | 11.51,17.17 10.14,17.17 PPU-V8C1-4:U$1.4 | PPU-V8C1-4:U$1.2 10.17,14.63 11.13,14.63 11.51,15.01 11.51,17.17
  L3/Power1 0.254: v6.81,20.47 11.26,20.47 11.89,19.84 v11.89,17.93
PPU-V8C1-4:TPIPD_OUT  (1 unrouted)
  L1/TopSignal 0.254: PPU-V8C1-4:R2.1 9.66,18.72 PPU-V8C1-4:TP2.1 6.27,18.72 PPU-V8C1-4:U$1.5
TP1_OUT  (via drill 0.2)  (2 unrouted)
  L1/TopSignal 0.254: v2.14,35.59 1.76,34.95 1.7,34.91 | 2.64,40.92 2.64,42.57 2.64,44.37 5.4,47.13 5.45,47.19 | 2.64,40.92 v2.64,37.87 | v1.33,42.62 2.64,41.27 2.64,40.92
  L16/BottomSignal 0.254: v2.64,37.87 2.64,37.39 2.49,37.24 2.49,35.97 2.14,35.61 v2.14,35.59 | J4.11 J4.13 0.8,42.6 v1.33,42.62

### Text on the board
tPlace: 4:TP3 | 2:TP3 | 4:R1 | 4:L1 | 2:SJ1 | 2:TP1 | 2:R1 | 4:T1 | 4:CT1 | 4:C1 | 2:U$2 | 4:SJ1 | 2:C1 | 2:TP2 | 2:R2 | 4:Q11 | 2:CT1 | GWU MCAT / SUBSYSTEM / CANYVAL-X | 2:L1 | 4:R2 | 4:TP2 | 4:U$1 | 2:T1 | 4:TP1 | 2:Q11
bPlace: 4:T1 | 2:T1